# Altium project JlinkAdapter.PrjPcb
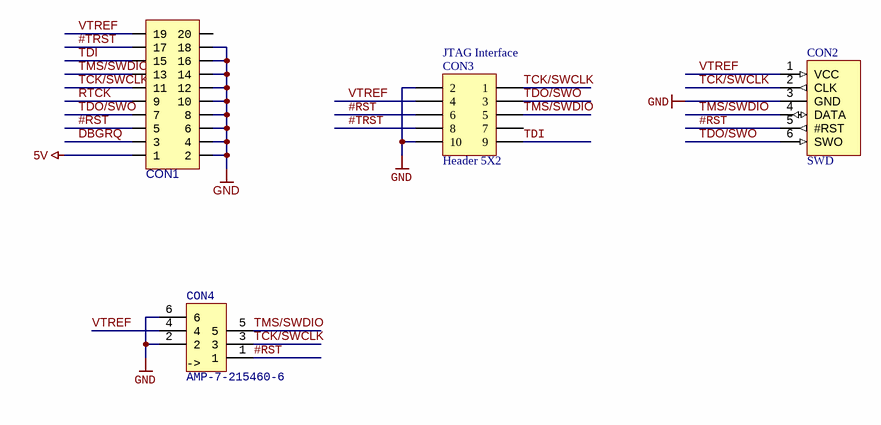
[diagram p0: JlinkAdapter.SchDoc]
1 sheet, 4 parts. Net scope: global (net labels, ports and power ports of the same name join across sheets).
Board file: JlinkAdapter.PcbDoc

## Sheet JlinkAdapter.SchDoc: Test
size A4; DrawnBy: Łukasz Przeniosło; Organization: Zachodniopomorski; Address1: Uniwersytet Technologiczny; Address2: w Szczecinie; Address3: Wydział Elektryczny; DocumentNumber: 1111; Revision: 1.0; SheetNumber: 0; SheetTotal: 0

### Parts
CON1  Header_2x10  [HEADER_2X10_ANGLE_FEMALE]  (value not drawn)
CON2  SWD  [HEADER_6]
CON3  Header 5X2  [HDR1X10_1.27mmp_MIN]
CON4  AMP-7-215460-6  [AMP-7-215460-6]

### Nets
5V: CON1.1
GND: CON1.2 CON1.4 CON1.6 CON1.8 CON1.10 CON1.12 CON1.14 CON1.16 CON1.18 CON2.3(GND) CON3.2 CON3.10 CON4.2 CON4.6
#RST: CON1.5 CON2.5(#RST) CON3.6 CON4.1
#TRST: CON1.17 CON3.8
DBGRQ: CON1.3
RTCK: CON1.9
TCK/SWCLK: CON1.11 CON2.2(CLK) CON3.1 CON4.3
TDI: CON1.15 CON3.9
TDO/SWO: CON1.7 CON2.6(SWO) CON3.3
TMS/SWDIO: CON1.13 CON2.4(DATA) CON3.5 CON4.5
VTREF: CON1.19 CON2.1(VCC) CON3.4 CON4.4

Not connected (* = marked no-connect by the designer): CON1 20; CON3 7

### Notes on the sheet
- (near CON3) JTAG Interface
- Title
- Size:
- Date:
- A4
- Author:
- Time:
- Sheet
- of
- File:
- (in symbol AMP-7-215460-6) ->

### Library data of the parts
CON2 = SWD-HEADER
CON3 = Header 5X2: Header, 5-Pin, Dual row; LatestRevisionDate: 17-Jul-2002; LatestRevisionNote: Re-released for DXP Platform.; Publisher: Altium Limited